# Altium schematic sheet iso_lvds_rx.SchDoc: Rx iso drivers
size A2; Author: Cassio Berni; DrawnBy: CCB; Revision: 1_01; SheetNumber: 2; SheetTotal: 4; PageSetup: Record=PageOptions|CenterHorizontal=True|CenterVertical=True|PrintScale=0.50|XCorrection=1.00|YCorrection=1.00|PrintKind=0|BorderSize=5000000|LeftOffset=0|BottomOffset=0|Orientation=2|PaperLength=1000|PaperWidth=1000|Scale=100|PaperSource=7|PrintQuality=-3|MediaType=1|DitherType=10|PrintScaleMode=1|PaperKind=A4|PaperIndex=9
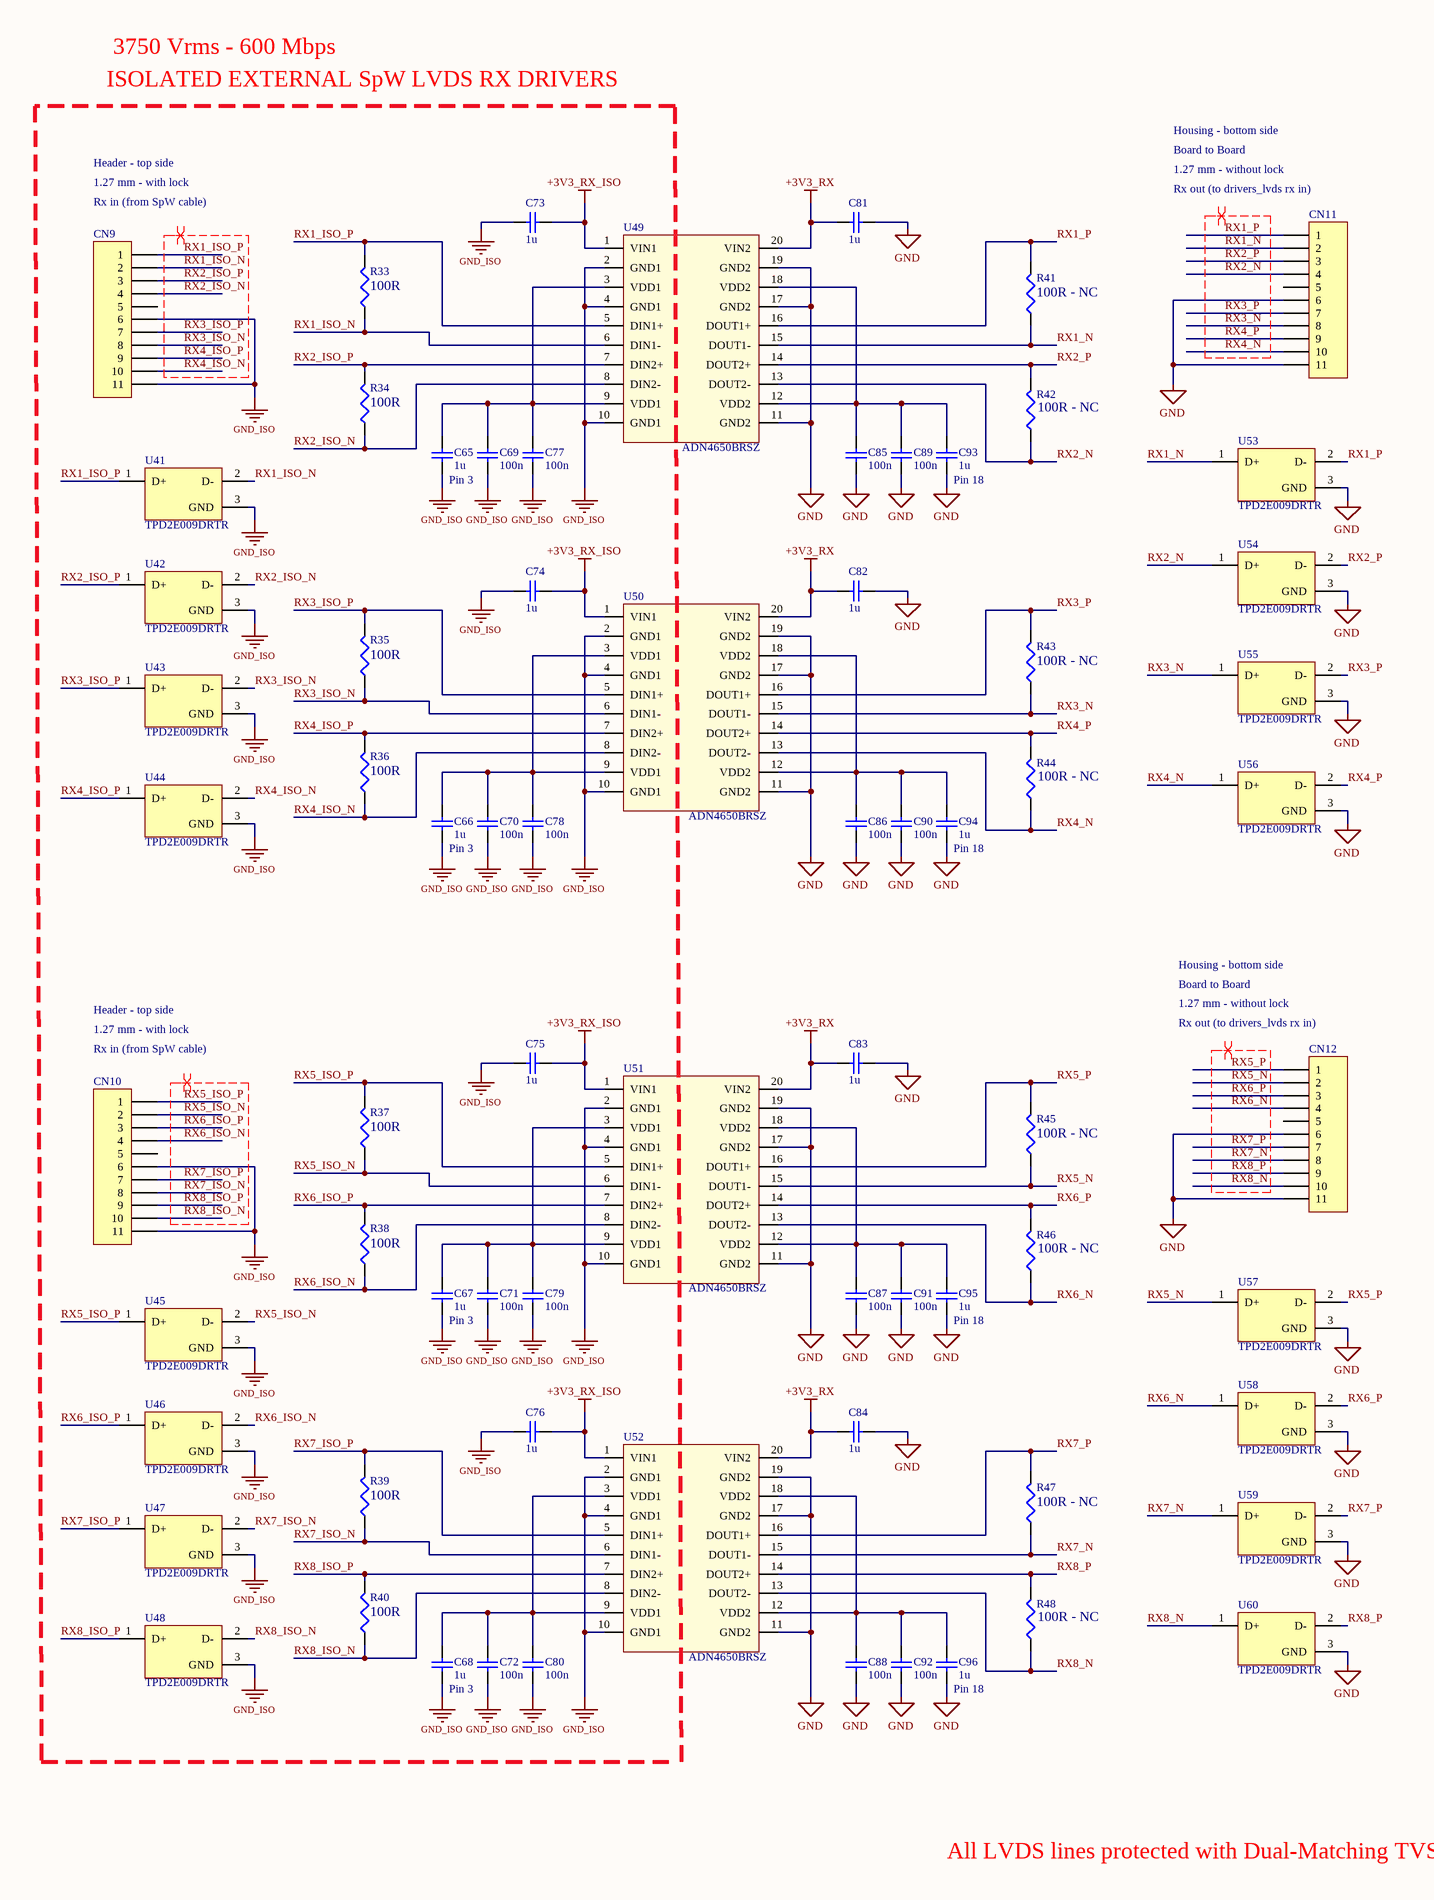
[diagram p0: iso_lvds_rx.SchDoc, left]
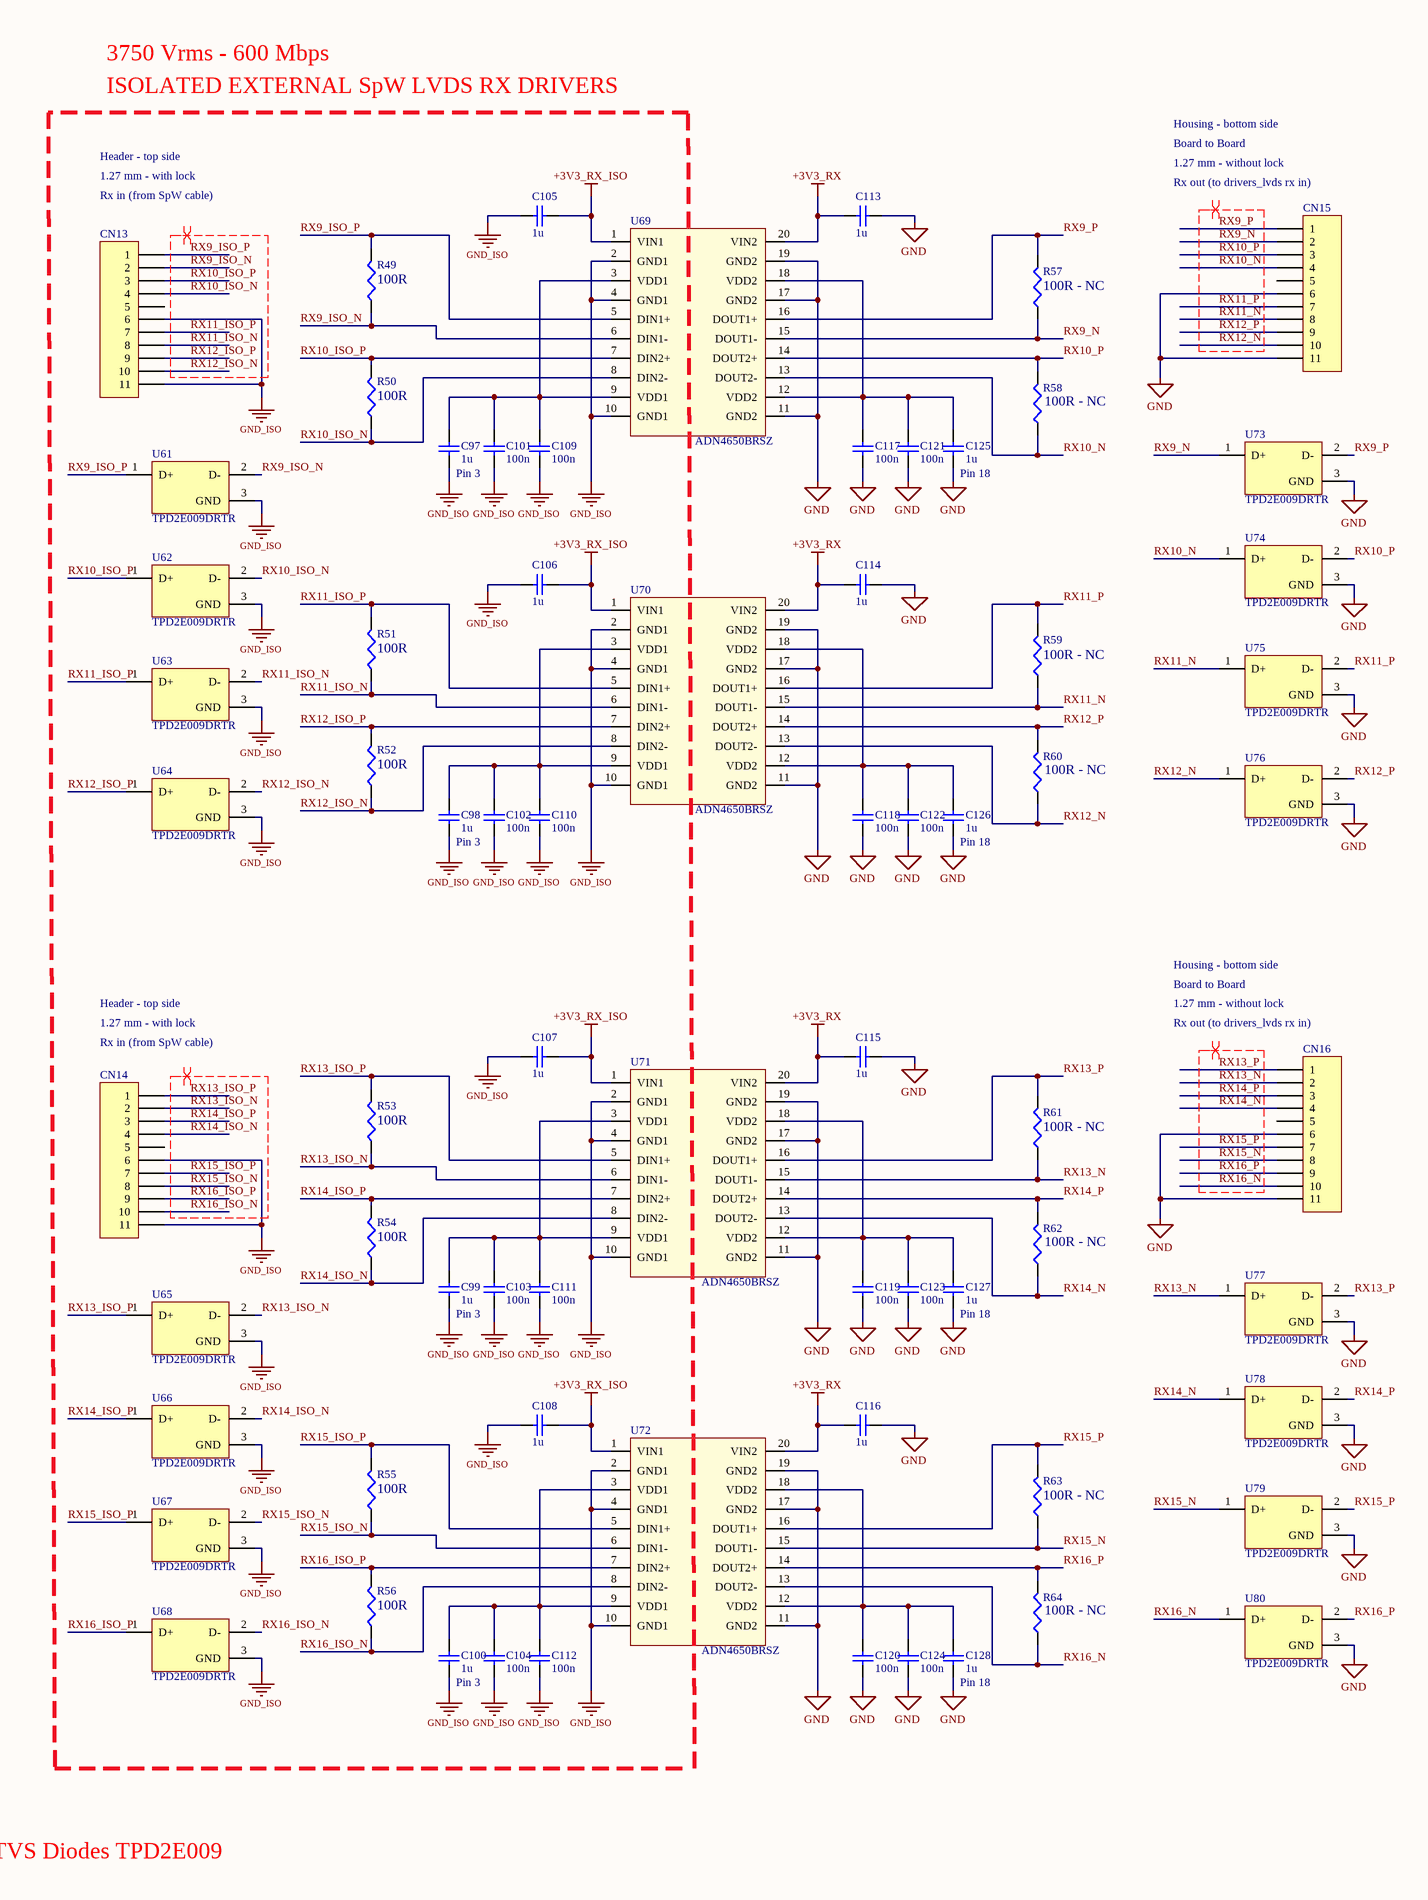
[diagram p1: iso_lvds_rx.SchDoc, right]

## Parts
C65  Valor: 1u  [0402-cap]  (hidden comment: Capacitor Cerâmico SMD)
C66  Valor: 1u  [0402-cap]  (hidden comment: Capacitor Cerâmico SMD)
C67  Valor: 1u  [0402-cap]  (hidden comment: Capacitor Cerâmico SMD)
C68  Valor: 1u  [0402-cap]  (hidden comment: Capacitor Cerâmico SMD)
C69  Valor: 100n  [0402-cap]  (hidden comment: Capacitor Cerâmico SMD)
C70  Valor: 100n  [0402-cap]  (hidden comment: Capacitor Cerâmico SMD)
C71  Valor: 100n  [0402-cap]  (hidden comment: Capacitor Cerâmico SMD)
C72  Valor: 100n  [0402-cap]  (hidden comment: Capacitor Cerâmico SMD)
C73  Valor: 1u  [0402-cap]  (hidden comment: Capacitor Cerâmico SMD)
C74  Valor: 1u  [0402-cap]  (hidden comment: Capacitor Cerâmico SMD)
C75  Valor: 1u  [0402-cap]  (hidden comment: Capacitor Cerâmico SMD)
C76  Valor: 1u  [0402-cap]  (hidden comment: Capacitor Cerâmico SMD)
C77  Valor: 100n  [0402-cap]  (hidden comment: Capacitor Cerâmico SMD)
C78  Valor: 100n  [0402-cap]  (hidden comment: Capacitor Cerâmico SMD)
C79  Valor: 100n  [0402-cap]  (hidden comment: Capacitor Cerâmico SMD)
C80  Valor: 100n  [0402-cap]  (hidden comment: Capacitor Cerâmico SMD)
C81  Valor: 1u  [0402-cap]  (hidden comment: Capacitor Cerâmico SMD)
C82  Valor: 1u  [0402-cap]  (hidden comment: Capacitor Cerâmico SMD)
C83  Valor: 1u  [0402-cap]  (hidden comment: Capacitor Cerâmico SMD)
C84  Valor: 1u  [0402-cap]  (hidden comment: Capacitor Cerâmico SMD)
C85  Valor: 100n  [0402-cap]  (hidden comment: Capacitor Cerâmico SMD)
C86  Valor: 100n  [0402-cap]  (hidden comment: Capacitor Cerâmico SMD)
C87  Valor: 100n  [0402-cap]  (hidden comment: Capacitor Cerâmico SMD)
C88  Valor: 100n  [0402-cap]  (hidden comment: Capacitor Cerâmico SMD)
C89  Valor: 100n  [0402-cap]  (hidden comment: Capacitor Cerâmico SMD)
C90  Valor: 100n  [0402-cap]  (hidden comment: Capacitor Cerâmico SMD)
C91  Valor: 100n  [0402-cap]  (hidden comment: Capacitor Cerâmico SMD)
C92  Valor: 100n  [0402-cap]  (hidden comment: Capacitor Cerâmico SMD)
C93  Valor: 1u  [0402-cap]  (hidden comment: Capacitor Cerâmico SMD)
C94  Valor: 1u  [0402-cap]  (hidden comment: Capacitor Cerâmico SMD)
C95  Valor: 1u  [0402-cap]  (hidden comment: Capacitor Cerâmico SMD)
C96  Valor: 1u  [0402-cap]  (hidden comment: Capacitor Cerâmico SMD)
C97  Valor: 1u  [0402-cap]  (hidden comment: Capacitor Cerâmico SMD)
C98  Valor: 1u  [0402-cap]  (hidden comment: Capacitor Cerâmico SMD)
C99  Valor: 1u  [0402-cap]  (hidden comment: Capacitor Cerâmico SMD)
C100  Valor: 1u  [0402-cap]  (hidden comment: Capacitor Cerâmico SMD)
C101  Valor: 100n  [0402-cap]  (hidden comment: Capacitor Cerâmico SMD)
C102  Valor: 100n  [0402-cap]  (hidden comment: Capacitor Cerâmico SMD)
C103  Valor: 100n  [0402-cap]  (hidden comment: Capacitor Cerâmico SMD)
C104  Valor: 100n  [0402-cap]  (hidden comment: Capacitor Cerâmico SMD)
C105  Valor: 1u  [0402-cap]  (hidden comment: Capacitor Cerâmico SMD)
C106  Valor: 1u  [0402-cap]  (hidden comment: Capacitor Cerâmico SMD)
C107  Valor: 1u  [0402-cap]  (hidden comment: Capacitor Cerâmico SMD)
C108  Valor: 1u  [0402-cap]  (hidden comment: Capacitor Cerâmico SMD)
C109  Valor: 100n  [0402-cap]  (hidden comment: Capacitor Cerâmico SMD)
C110  Valor: 100n  [0402-cap]  (hidden comment: Capacitor Cerâmico SMD)
C111  Valor: 100n  [0402-cap]  (hidden comment: Capacitor Cerâmico SMD)
C112  Valor: 100n  [0402-cap]  (hidden comment: Capacitor Cerâmico SMD)
C113  Valor: 1u  [0402-cap]  (hidden comment: Capacitor Cerâmico SMD)
C114  Valor: 1u  [0402-cap]  (hidden comment: Capacitor Cerâmico SMD)
C115  Valor: 1u  [0402-cap]  (hidden comment: Capacitor Cerâmico SMD)
C116  Valor: 1u  [0402-cap]  (hidden comment: Capacitor Cerâmico SMD)
C117  Valor: 100n  [0402-cap]  (hidden comment: Capacitor Cerâmico SMD)
C118  Valor: 100n  [0402-cap]  (hidden comment: Capacitor Cerâmico SMD)
C119  Valor: 100n  [0402-cap]  (hidden comment: Capacitor Cerâmico SMD)
C120  Valor: 100n  [0402-cap]  (hidden comment: Capacitor Cerâmico SMD)
C121  Valor: 100n  [0402-cap]  (hidden comment: Capacitor Cerâmico SMD)
C122  Valor: 100n  [0402-cap]  (hidden comment: Capacitor Cerâmico SMD)
C123  Valor: 100n  [0402-cap]  (hidden comment: Capacitor Cerâmico SMD)
C124  Valor: 100n  [0402-cap]  (hidden comment: Capacitor Cerâmico SMD)
C125  Valor: 1u  [0402-cap]  (hidden comment: Capacitor Cerâmico SMD)
C126  Valor: 1u  [0402-cap]  (hidden comment: Capacitor Cerâmico SMD)
C127  Valor: 1u  [0402-cap]  (hidden comment: Capacitor Cerâmico SMD)
C128  Valor: 1u  [0402-cap]  (hidden comment: Capacitor Cerâmico SMD)
CN9  MHDR1X11  [MHDR1X11_Axonn]  (value not drawn)
CN10  MHDR1X11  [MHDR1X11_Axonn]  (value not drawn)
CN11  MHDR1X11  [MHDR1X11_Axonn]  (value not drawn)
CN12  MHDR1X11  [MHDR1X11_Axonn]  (value not drawn)
CN13  MHDR1X11  [MHDR1X11_Axonn]  (value not drawn)
CN14  MHDR1X11  [MHDR1X11_Axonn]  (value not drawn)
CN15  MHDR1X11  [MHDR1X11_Axonn]  (value not drawn)
CN16  MHDR1X11  [MHDR1X11_Axonn]  (value not drawn)
R33  Valor: 100R  [0402-res]  (hidden comment: Res3)
R34  Valor: 100R  [0402-res]  (hidden comment: Res3)
R35  Valor: 100R  [0402-res]  (hidden comment: Res3)
R36  Valor: 100R  [0402-res]  (hidden comment: Res3)
R37  Valor: 100R  [0402-res]  (hidden comment: Res3)
R38  Valor: 100R  [0402-res]  (hidden comment: Res3)
R39  Valor: 100R  [0402-res]  (hidden comment: Res3)
R40  Valor: 100R  [0402-res]  (hidden comment: Res3)
R41  Valor: 100R - NC  [0402-res]  (hidden comment: Res3)
R42  Valor: 100R - NC  [0402-res]  (hidden comment: Res3)
R43  Valor: 100R - NC  [0402-res]  (hidden comment: Res3)
R44  Valor: 100R - NC  [0402-res]  (hidden comment: Res3)
R45  Valor: 100R - NC  [0402-res]  (hidden comment: Res3)
R46  Valor: 100R - NC  [0402-res]  (hidden comment: Res3)
R47  Valor: 100R - NC  [0402-res]  (hidden comment: Res3)
R48  Valor: 100R - NC  [0402-res]  (hidden comment: Res3)
R49  Valor: 100R  [0402-res]  (hidden comment: Res3)
R50  Valor: 100R  [0402-res]  (hidden comment: Res3)
R51  Valor: 100R  [0402-res]  (hidden comment: Res3)
R52  Valor: 100R  [0402-res]  (hidden comment: Res3)
R53  Valor: 100R  [0402-res]  (hidden comment: Res3)
R54  Valor: 100R  [0402-res]  (hidden comment: Res3)
R55  Valor: 100R  [0402-res]  (hidden comment: Res3)
R56  Valor: 100R  [0402-res]  (hidden comment: Res3)
R57  Valor: 100R - NC  [0402-res]  (hidden comment: Res3)
R58  Valor: 100R - NC  [0402-res]  (hidden comment: Res3)
R59  Valor: 100R - NC  [0402-res]  (hidden comment: Res3)
R60  Valor: 100R - NC  [0402-res]  (hidden comment: Res3)
R61  Valor: 100R - NC  [0402-res]  (hidden comment: Res3)
R62  Valor: 100R - NC  [0402-res]  (hidden comment: Res3)
R63  Valor: 100R - NC  [0402-res]  (hidden comment: Res3)
R64  Valor: 100R - NC  [0402-res]  (hidden comment: Res3)
U41  TPD2E009DRTR  [DRT3]
U42  TPD2E009DRTR  [DRT3]
U43  TPD2E009DRTR  [DRT3]
U44  TPD2E009DRTR  [DRT3]
U45  TPD2E009DRTR  [DRT3]
U46  TPD2E009DRTR  [DRT3]
U47  TPD2E009DRTR  [DRT3]
U48  TPD2E009DRTR  [DRT3]
U49  ADN4650BRSZ  [SSOP-RS-20]
U50  ADN4650BRSZ  [SSOP-RS-20]
U51  ADN4650BRSZ  [SSOP-RS-20]
U52  ADN4650BRSZ  [SSOP-RS-20]
U53  TPD2E009DRTR  [DRT3]
U54  TPD2E009DRTR  [DRT3]
U55  TPD2E009DRTR  [DRT3]
U56  TPD2E009DRTR  [DRT3]
U57  TPD2E009DRTR  [DRT3]
U58  TPD2E009DRTR  [DRT3]
U59  TPD2E009DRTR  [DRT3]
U60  TPD2E009DRTR  [DRT3]
U61  TPD2E009DRTR  [DRT3]
U62  TPD2E009DRTR  [DRT3]
U63  TPD2E009DRTR  [DRT3]
U64  TPD2E009DRTR  [DRT3]
U65  TPD2E009DRTR  [DRT3]
U66  TPD2E009DRTR  [DRT3]
U67  TPD2E009DRTR  [DRT3]
U68  TPD2E009DRTR  [DRT3]
U69  ADN4650BRSZ  [SSOP-RS-20]
U70  ADN4650BRSZ  [SSOP-RS-20]
U71  ADN4650BRSZ  [SSOP-RS-20]
U72  ADN4650BRSZ  [SSOP-RS-20]
U73  TPD2E009DRTR  [DRT3]
U74  TPD2E009DRTR  [DRT3]
U75  TPD2E009DRTR  [DRT3]
U76  TPD2E009DRTR  [DRT3]
U77  TPD2E009DRTR  [DRT3]
U78  TPD2E009DRTR  [DRT3]
U79  TPD2E009DRTR  [DRT3]
U80  TPD2E009DRTR  [DRT3]

## Nets
+3V3_RX: C81.2 C82.2 C83.2 C84.2 C113.2 C114.2 C115.2 C116.2 U49.20(VIN2) U50.20(VIN2) U51.20(VIN2) U52.20(VIN2) U69.20(VIN2) U70.20(VIN2) U71.20(VIN2) U72.20(VIN2)
+3V3_RX_ISO: C73.1 C74.1 C75.1 C76.1 C105.1 C106.1 C107.1 C108.1 U49.1(VIN1) U50.1(VIN1) U51.1(VIN1) U52.1(VIN1) U69.1(VIN1) U70.1(VIN1) U71.1(VIN1) U72.1(VIN1)
GND: C81.1 C82.1 C83.1 C84.1 C85.1 C86.1 C87.1 C88.1 C89.1 C90.1 C91.1 C92.1 C93.1 C94.1 C95.1 C96.1 C113.1 C114.1 C115.1 C116.1 C117.1 C118.1 C119.1 C120.1 C121.1 C122.1 C123.1 C124.1 C125.1 C126.1 C127.1 C128.1 CN11.6 CN11.11 CN12.6 CN12.11 CN15.6 CN15.11 CN16.6 CN16.11 U49.11(GND2) U49.17(GND2) U49.19(GND2) U50.11(GND2) U50.17(GND2) U50.19(GND2) U51.11(GND2) U51.17(GND2) U51.19(GND2) U52.11(GND2) U52.17(GND2) U52.19(GND2) U53.3(GND) U54.3(GND) U55.3(GND) U56.3(GND) U57.3(GND) U58.3(GND) U59.3(GND) U60.3(GND) U69.11(GND2) U69.17(GND2) U69.19(GND2) U70.11(GND2) U70.17(GND2) U70.19(GND2) U71.11(GND2) U71.17(GND2) U71.19(GND2) U72.11(GND2) U72.17(GND2) U72.19(GND2) U73.3(GND) U74.3(GND) U75.3(GND) U76.3(GND) U77.3(GND) U78.3(GND) U79.3(GND) U80.3(GND)
GND_ISO: C65.1 C66.1 C67.1 C68.1 C69.1 C70.1 C71.1 C72.1 C73.2 C74.2 C75.2 C76.2 C77.1 C78.1 C79.1 C80.1 C97.1 C98.1 C99.1 C100.1 C101.1 C102.1 C103.1 C104.1 C105.2 C106.2 C107.2 C108.2 C109.1 C110.1 C111.1 C112.1 CN9.6 CN9.11 CN10.6 CN10.11 CN13.6 CN13.11 CN14.6 CN14.11 U41.3(GND) U42.3(GND) U43.3(GND) U44.3(GND) U45.3(GND) U46.3(GND) U47.3(GND) U48.3(GND) U49.2(GND1) U49.4(GND1) U49.10(GND1) U50.2(GND1) U50.4(GND1) U50.10(GND1) U51.2(GND1) U51.4(GND1) U51.10(GND1) U52.2(GND1) U52.4(GND1) U52.10(GND1) U61.3(GND) U62.3(GND) U63.3(GND) U64.3(GND) U65.3(GND) U66.3(GND) U67.3(GND) U68.3(GND) U69.2(GND1) U69.4(GND1) U69.10(GND1) U70.2(GND1) U70.4(GND1) U70.10(GND1) U71.2(GND1) U71.4(GND1) U71.10(GND1) U72.2(GND1) U72.4(GND1) U72.10(GND1)
RX1_ISO_N: CN9.2 R33.1 U41.2(D-) U49.6(DIN1-)
RX1_ISO_P: CN9.1 R33.2 U41.1(D+) U49.5(DIN1+)
RX1_N: CN11.2 R41.1 U49.15(DOUT1-) U53.1(D+)
RX1_P: CN11.1 R41.2 U49.16(DOUT1+) U53.2(D-)
RX2_ISO_N: CN9.4 R34.1 U42.2(D-) U49.8(DIN2-)
RX2_ISO_P: CN9.3 R34.2 U42.1(D+) U49.7(DIN2+)
RX2_N: CN11.4 R42.1 U49.13(DOUT2-) U54.1(D+)
RX2_P: CN11.3 R42.2 U49.14(DOUT2+) U54.2(D-)
RX3_ISO_N: CN9.8 R35.1 U43.2(D-) U50.6(DIN1-)
RX3_ISO_P: CN9.7 R35.2 U43.1(D+) U50.5(DIN1+)
RX3_N: CN11.8 R43.1 U50.15(DOUT1-) U55.1(D+)
RX3_P: CN11.7 R43.2 U50.16(DOUT1+) U55.2(D-)
RX4_ISO_N: CN9.10 R36.1 U44.2(D-) U50.8(DIN2-)
RX4_ISO_P: CN9.9 R36.2 U44.1(D+) U50.7(DIN2+)
RX4_N: CN11.10 R44.1 U50.13(DOUT2-) U56.1(D+)
RX4_P: CN11.9 R44.2 U50.14(DOUT2+) U56.2(D-)
RX5_ISO_N: CN10.2 R37.1 U45.2(D-) U51.6(DIN1-)
RX5_ISO_P: CN10.1 R37.2 U45.1(D+) U51.5(DIN1+)
RX5_N: CN12.2 R45.1 U51.15(DOUT1-) U57.1(D+)
RX5_P: CN12.1 R45.2 U51.16(DOUT1+) U57.2(D-)
RX6_ISO_N: CN10.4 R38.1 U46.2(D-) U51.8(DIN2-)
RX6_ISO_P: CN10.3 R38.2 U46.1(D+) U51.7(DIN2+)
RX6_N: CN12.4 R46.1 U51.13(DOUT2-) U58.1(D+)
RX6_P: CN12.3 R46.2 U51.14(DOUT2+) U58.2(D-)
RX7_ISO_N: CN10.8 R39.1 U47.2(D-) U52.6(DIN1-)
RX7_ISO_P: CN10.7 R39.2 U47.1(D+) U52.5(DIN1+)
RX7_N: CN12.8 R47.1 U52.15(DOUT1-) U59.1(D+)
RX7_P: CN12.7 R47.2 U52.16(DOUT1+) U59.2(D-)
RX8_ISO_N: CN10.10 R40.1 U48.2(D-) U52.8(DIN2-)
RX8_ISO_P: CN10.9 R40.2 U48.1(D+) U52.7(DIN2+)
RX8_N: CN12.10 R48.1 U52.13(DOUT2-) U60.1(D+)
RX8_P: CN12.9 R48.2 U52.14(DOUT2+) U60.2(D-)
RX9_ISO_N: CN13.2 R49.1 U61.2(D-) U69.6(DIN1-)
RX9_ISO_P: CN13.1 R49.2 U61.1(D+) U69.5(DIN1+)
RX9_N: CN15.2 R57.1 U69.15(DOUT1-) U73.1(D+)
RX9_P: CN15.1 R57.2 U69.16(DOUT1+) U73.2(D-)
RX10_ISO_N: CN13.4 R50.1 U62.2(D-) U69.8(DIN2-)
RX10_ISO_P: CN13.3 R50.2 U62.1(D+) U69.7(DIN2+)
RX10_N: CN15.4 R58.1 U69.13(DOUT2-) U74.1(D+)
RX10_P: CN15.3 R58.2 U69.14(DOUT2+) U74.2(D-)
RX11_ISO_N: CN13.8 R51.1 U63.2(D-) U70.6(DIN1-)
RX11_ISO_P: CN13.7 R51.2 U63.1(D+) U70.5(DIN1+)
RX11_N: CN15.8 R59.1 U70.15(DOUT1-) U75.1(D+)
RX11_P: CN15.7 R59.2 U70.16(DOUT1+) U75.2(D-)
RX12_ISO_N: CN13.10 R52.1 U64.2(D-) U70.8(DIN2-)
RX12_ISO_P: CN13.9 R52.2 U64.1(D+) U70.7(DIN2+)
RX12_N: CN15.10 R60.1 U70.13(DOUT2-) U76.1(D+)
RX12_P: CN15.9 R60.2 U70.14(DOUT2+) U76.2(D-)
RX13_ISO_N: CN14.2 R53.1 U65.2(D-) U71.6(DIN1-)
RX13_ISO_P: CN14.1 R53.2 U65.1(D+) U71.5(DIN1+)
RX13_N: CN16.2 R61.1 U71.15(DOUT1-) U77.1(D+)
RX13_P: CN16.1 R61.2 U71.16(DOUT1+) U77.2(D-)
RX14_ISO_N: CN14.4 R54.1 U66.2(D-) U71.8(DIN2-)
RX14_ISO_P: CN14.3 R54.2 U66.1(D+) U71.7(DIN2+)
RX14_N: CN16.4 R62.1 U71.13(DOUT2-) U78.1(D+)
RX14_P: CN16.3 R62.2 U71.14(DOUT2+) U78.2(D-)
RX15_ISO_N: CN14.8 R55.1 U67.2(D-) U72.6(DIN1-)
RX15_ISO_P: CN14.7 R55.2 U67.1(D+) U72.5(DIN1+)
RX15_N: CN16.8 R63.1 U72.15(DOUT1-) U79.1(D+)
RX15_P: CN16.7 R63.2 U72.16(DOUT1+) U79.2(D-)
RX16_ISO_N: CN14.10 R56.1 U68.2(D-) U72.8(DIN2-)
RX16_ISO_P: CN14.9 R56.2 U68.1(D+) U72.7(DIN2+)
RX16_N: CN16.10 R64.1 U72.13(DOUT2-) U80.1(D+)
RX16_P: CN16.9 R64.2 U72.14(DOUT2+) U80.2(D-)
NetC65_2: C65.2 C69.2 C77.2 U49.3(VDD1) U49.9(VDD1)
NetC66_2: C66.2 C70.2 C78.2 U50.3(VDD1) U50.9(VDD1)
NetC67_2: C67.2 C71.2 C79.2 U51.3(VDD1) U51.9(VDD1)
NetC68_2: C68.2 C72.2 C80.2 U52.3(VDD1) U52.9(VDD1)
NetC85_2: C85.2 C89.2 C93.2 U49.12(VDD2) U49.18(VDD2)
NetC86_2: C86.2 C90.2 C94.2 U50.12(VDD2) U50.18(VDD2)
NetC87_2: C87.2 C91.2 C95.2 U51.12(VDD2) U51.18(VDD2)
NetC88_2: C88.2 C92.2 C96.2 U52.12(VDD2) U52.18(VDD2)
NetC97_2: C97.2 C101.2 C109.2 U69.3(VDD1) U69.9(VDD1)
NetC98_2: C98.2 C102.2 C110.2 U70.3(VDD1) U70.9(VDD1)
NetC99_2: C99.2 C103.2 C111.2 U71.3(VDD1) U71.9(VDD1)
NetC100_2: C100.2 C104.2 C112.2 U72.3(VDD1) U72.9(VDD1)
NetC117_2: C117.2 C121.2 C125.2 U69.12(VDD2) U69.18(VDD2)
NetC118_2: C118.2 C122.2 C126.2 U70.12(VDD2) U70.18(VDD2)
NetC119_2: C119.2 C123.2 C127.2 U71.12(VDD2) U71.18(VDD2)
NetC120_2: C120.2 C124.2 C128.2 U72.12(VDD2) U72.18(VDD2)

Not connected (* = marked no-connect by the designer): CN9 5; CN10 5; CN11 5; CN12 5; CN13 5; CN14 5; CN15 5; CN16 5

## Layout directives
differential pair; net class RX1_RX4_ISO; rule Differential Pairs Routing [Pref Gap = 10mil    Min Gap  = 10mil    Max Gap  = 10milPref Width = 10mil    Min Width  = 10mil    Max Width  = 10mil]: RX1_ISO_N, RX1_ISO_P, RX2_ISO_N, RX2_ISO_P, RX3_ISO_N, RX3_ISO_P, RX4_ISO_N, RX4_ISO_P
differential pair; net class RX5_RX8_ISO; rule Differential Pairs Routing [Pref Gap = 10mil    Min Gap  = 10mil    Max Gap  = 10milPref Width = 10mil    Min Width  = 10mil    Max Width  = 10mil]: RX5_ISO_N, RX5_ISO_P, RX6_ISO_N, RX6_ISO_P, RX7_ISO_N, RX7_ISO_P, RX8_ISO_N, RX8_ISO_P
differential pair; net class RX1_RX4; rule Differential Pairs Routing [Pref Gap = 10mil    Min Gap  = 10mil    Max Gap  = 10milPref Width = 10mil    Min Width  = 10mil    Max Width  = 10mil]: RX1_N, RX1_P, RX2_N, RX2_P, RX3_N, RX3_P, RX4_N, RX4_P
differential pair; net class RX5_RX8; rule Differential Pairs Routing [Pref Gap = 10mil    Min Gap  = 10mil    Max Gap  = 10milPref Width = 10mil    Min Width  = 10mil    Max Width  = 10mil]: RX5_N, RX5_P, RX6_N, RX6_P, RX7_N, RX7_P, RX8_N, RX8_P
differential pair; net class RX9_RX12_ISO; rule Differential Pairs Routing [Pref Gap = 10mil    Min Gap  = 10mil    Max Gap  = 10milPref Width = 10mil    Min Width  = 10mil    Max Width  = 10mil]: RX9_ISO_N, RX9_ISO_P, RX10_ISO_N, RX10_ISO_P, RX11_ISO_N, RX11_ISO_P, RX12_ISO_N, RX12_ISO_P
differential pair; net class RX13_RX16_ISO; rule Differential Pairs Routing [Pref Gap = 10mil    Min Gap  = 10mil    Max Gap  = 10milPref Width = 10mil    Min Width  = 10mil    Max Width  = 10mil]: RX13_ISO_N, RX13_ISO_P, RX14_ISO_N, RX14_ISO_P, RX15_ISO_N, RX15_ISO_P, RX16_ISO_N, RX16_ISO_P
differential pair; net class RX9_RX12; rule Differential Pairs Routing [Pref Gap = 10mil    Min Gap  = 10mil    Max Gap  = 10milPref Width = 10mil    Min Width  = 10mil    Max Width  = 10mil]: RX9_N, RX9_P, RX10_N, RX10_P, RX11_N, RX11_P, RX12_N, RX12_P
differential pair; net class RX13_RX16; rule Differential Pairs Routing [Pref Gap = 10mil    Min Gap  = 10mil    Max Gap  = 10milPref Width = 10mil    Min Width  = 10mil    Max Width  = 10mil]: RX13_N, RX13_P, RX14_N, RX14_P, RX15_N, RX15_P, RX16_N, RX16_P

## Notes on the sheet
- 3750 Vrms - 600 Mbps
- ISOLATED EXTERNAL SpW LVDS RX DRIVERS
- Header - top side
- 1.27 mm - with lock
- Housing - bottom side
- Board to Board
- 1.27 mm - without lock
- (near CN11) Rx out (to drivers_lvds rx in)
- (near CN15) Rx out (to drivers_lvds rx in)
- (near CN9) Rx in (from SpW cable)
- Rx in (from SpW cable)
- Pin 3
- (near C93) Pin 18
- (near C125) Pin 18
- (near C94) Pin 18
- (near C126) Pin 18
- (near CN12) Rx out (to drivers_lvds rx in)
- (near CN16) Rx out (to drivers_lvds rx in)
- (near CN10) Rx in (from SpW cable)
- (near CN14) Rx in (from SpW cable)
- (near C95) Pin 18
- (near C127) Pin 18
- (near C96) Pin 18
- (near C128) Pin 18
- All LVDS lines protected with Dual-Matching TVS Diodes TPD2E009

## Library data of the parts
CN9-CN16 = MHDR1X11: Header, 11-Pin; LatestRevisionDate: 17-Jul-2002; LatestRevisionNote: Re-released for DXP Platform.; Publisher: Altium Limited
R33-R64 = Res3: Resistor; Grupo: 01
U41-U48 U53-U68 U73-U80 = TPD2E009DRTR: ESD Protection Array for High-Speed Data Interfaces, 2 Channels, -40 to +85 degC, 3-pin SOT (DRT), Green (RoHS & no Sb/Br); Manufacturer: Texas Instruments; Breakdown Voltage(Min)(V): 9; Differential Capacitance(pF): 0.01; IEC 61000-4-2 Air-Gap(+/- kV): 8; IO Capacitance(Typ)(pF): 0.7; IO Leakage Current(nA): 10; Serial ATA / eSATA: TRUE; SubFamily: ESD Solution; DatasheetVersion: SLVS953A; PackageVersion: revD, Jun-2008; PackageReference: DRT3; PackageDescription: 3-Flat Lead Plastic Small Outline, 1 x 1 mm (inc leads), 0.35 mm Pitch; Supplier 1: Digi-Key; Supplier Part Number 1: 296-25410-2-ND; Supplier 2: Digi-Key; Supplier Part Number 2: 296-25410-1-ND; Supplier 3: Digi-Key; Supplier Part Number 3: 296-25410-6-ND; Supplier 4: Newark; Supplier Part Number 4: 50R8093; Supplier 5: Mouser; Supplier Part Number 5: 595-TPD2E009DRTR; Eco-Plan: Green (RoHS & no Sb/Br); IEC 61000-4-2 Contact(+/- kV): 8; Mounting Technology: Surface Mount; PartNumber: TPD2E009DRTR; ComponentLink1Description: Datasheet; ComponentLink1URL: http://www.ti.com/general/docs/lit/getliterature.tsp?genericPartNumber=TPD2E009&fileType=pdf; ComponentLink2Description: URL Link1; ComponentLink2URL: SamplesURL:http://www.ti.com/product/tpd2e009#samples
U49-U52 U69-U72 = ADN4650BRSZ: 5 kV RMS/3.75 kV RMS, 600 Mbps,  Dual-Channel LVDS Isolators; Fabricante: Analog Devices; Grupo: 07; Encapsulamento: SSOP-20; Valor: *; Obs: *; Datasheet: *; Part Number: ADN4650BRSZ